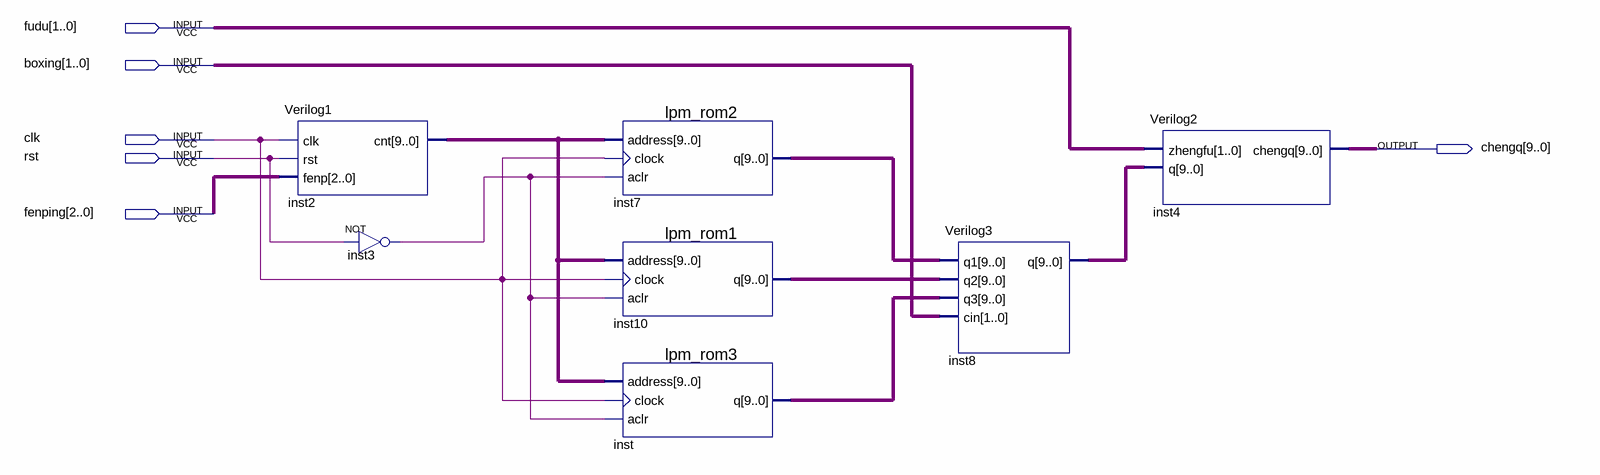
[diagram p0: schematic sheet]
// Quartus schematic shiyan15.bdf as structural Verilog: 7 symbols, 6 pins
module shiyan15 (
  input  [1:0] fudu,
  input  [1:0] boxing,
  input  clk,
  input  rst,
  input  [2:0] fenping,
  output [9:0] chengq
);

  wire inst3_out;
  wire [9:0] inst2_cnt, inst7_q, inst8_q, inst10_q, inst_q;

  Verilog1 inst2 (.clk(clk), .rst(rst), .fenp(fenping), .cnt(inst2_cnt));
  not inst3 (inst3_out, rst);
  lpm_rom2 inst7 (.address(inst2_cnt), .clock(clk), .aclr(inst3_out), .q(inst7_q));
  lpm_rom1 inst10 (.address(inst2_cnt), .clock(clk), .aclr(inst3_out), .q(inst10_q));
  lpm_rom3 inst (.address(inst2_cnt), .clock(clk), .aclr(inst3_out), .q(inst_q));
  Verilog3 inst8 (.q1(inst7_q), .q2(inst10_q), .q3(inst_q), .cin(boxing), .q(inst8_q));
  Verilog2 inst4 (.zhengfu(fudu), .q(inst8_q), .chengq(chengq));
endmodule
